# EAGLE design twip-pb1A (EAGLE 9.2.1)
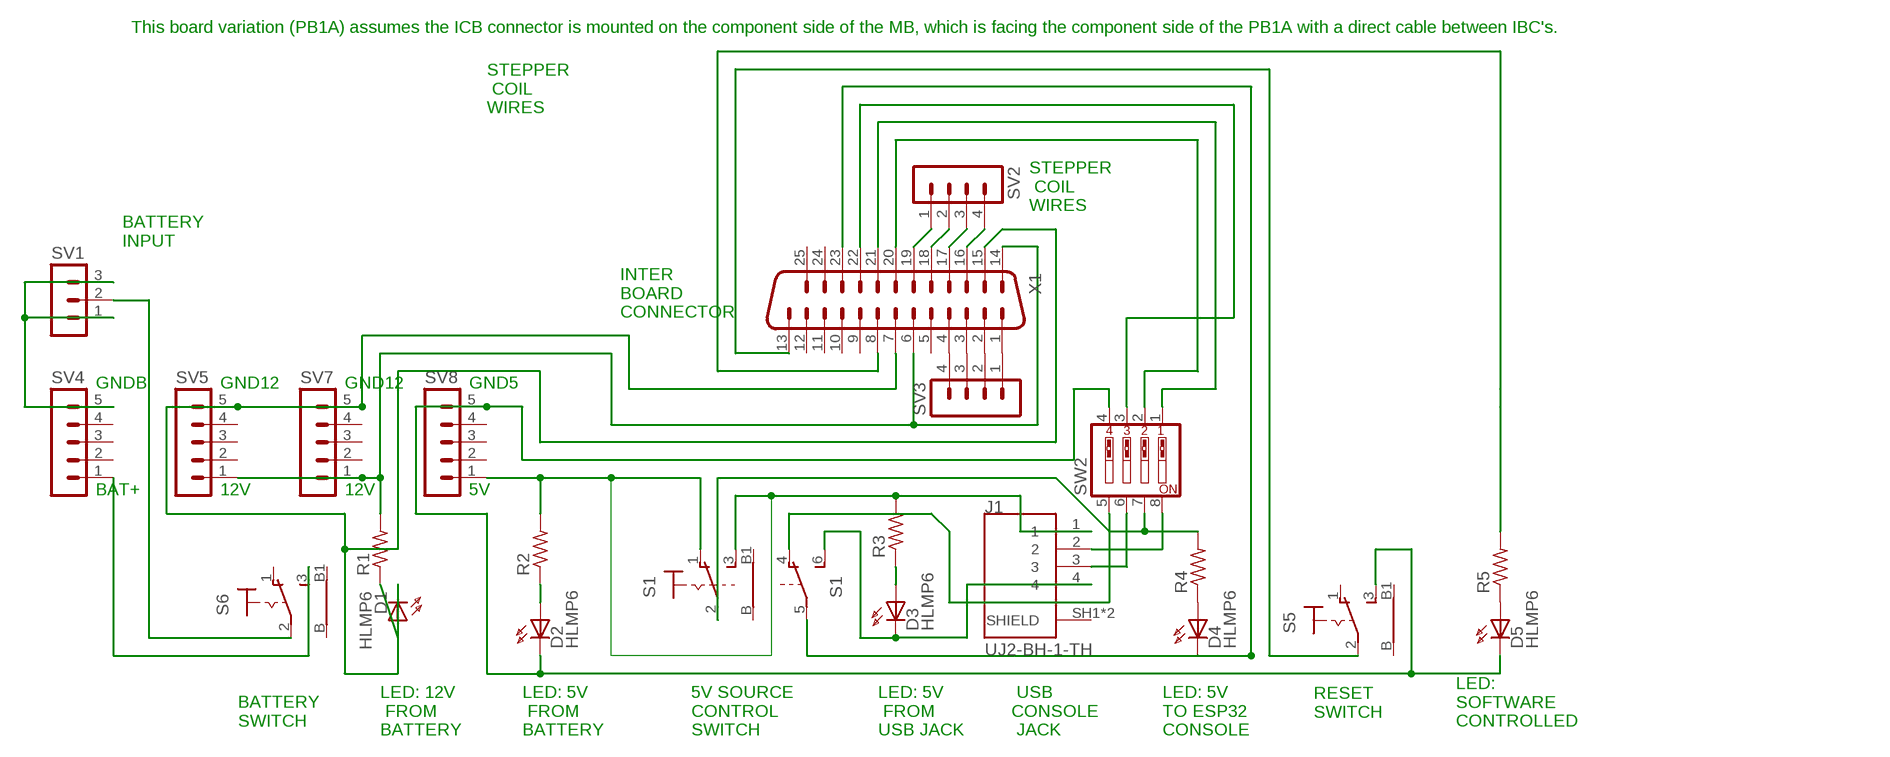
[diagram p0: schematic, sheet 1]

## Parts
D1  HLMP6  [HLMP6]
D2  HLMP6  [HLMP6]
D3  HLMP6  [HLMP6]
D4  HLMP6  [HLMP6]
D5  HLMP6  [HLMP6]
J1  UJ2-BH-1-TH  [CUI_UJ2-BH-1-TH]
R1  R-US_0207/5V  [0207/5V]
R2  R-US_0207/5V  [0207/5V]
R3  R-US_0207/5V  [0207/5V]
R4  R-US_0207/5V  [0207/5V]
R5  R-US_0207/5V  [0207/5V]
S1  9070-2W  [9070-2W]
S5  9070-1W  [9070-1W]
S6  9070-1W  [9070-1W]
SV1  MA03-1  [MA03-1]
SV2  MA04-1  [MA04-1]
SV3  MA04-1  [MA04-1]
SV4  MA05-1  [MA05-1]
SV5  MA05-1  [MA05-1]
SV7  MA05-1  [MA05-1]
SV8  MA05-1  [MA05-1]
SW2  SW_DIP-4  [EDG-04]
X1  M25VP  [M25VP]

## Nets
N$1: D1.A R1.1
N$2: D2.A R2.1
N$3: D3.A R3.1
N$4: D4.A R4.1
N$5: D5.A R5.1
N$6: SV1.1 SV1.3 SV4.5
N$7: S6.2(P) SV1.2
N$8: R1.2 SV5.1 SV7.1 X1.6 X1.14
N$9: J1.1 R2.2 R3.2 S1.1(1:O) S1.3(1:S) SV8.1
N$10: S6.3(S) SV4.1
N$11: SV2.1 X1.19
N$13: J1.2 SW2.8
N$14: SV3.4 X1.4
N$15: SV3.3 X1.3
N$16: SV3.2 X1.2
N$17: SV3.1 X1.1
N$18: SV2.2 X1.18
N$19: SV2.3 X1.17
N$20: SV2.4 X1.16
N$21: R5.2 X1.8
N$22: R4.2 S1.2(1:P) SW2.7
N$23: D3.K J1.4 S1.6(B:S)
N$24: SW2.1 X1.21
N$25: SW2.3 X1.22
N$26: SW2.2 X1.20
N$27: D4.K S1.5(B:P) X1.23
N$28: S5.2(P) X1.13
N$29: D1.K SV5.5 SV7.5 X1.7 X1.15
N$30: S1.4(B:O) SW2.5
N$31: D2.K D5.K S5.3(S) SV8.5 SW2.4
N$33: J1.3 SW2.6
Unconnected: J1.SH1(SHIELD) J1.SH2(SHIELD) S1.B1(1:B1) S1.B(1:B) S5.1(O) S5.B S5.B1 S6.1(O) S6.B S6.B1 SV4.2 SV4.3 SV4.4 SV5.2 SV5.3 SV5.4 SV7.2 SV7.3 SV7.4 SV8.2 SV8.3 SV8.4 X1.5 X1.9 X1.10 X1.11 X1.12 X1.24 X1.25 X1.G1 X1.G2

## Notes on the sheet
- This board variation (PB1A) assumes the ICB connector is mounted on the component side of the MB, which is facing the component side of the PB1A with a direct cable between IBC's.
- STEPPER
   COIL
  WIRES
- STEPPER
   COIL
  WIRES
- BATTERY
  INPUT
- INTER 
  BOARD 
  CONNECTOR
- GNDB | GND12 | GND12 | GND5
- BAT+ | 12V | 12V | 5V
- RESET
  SWITCH
- BATTERY 
  SWITCH
- LED: 
  SOFTWARE
  CONTROLLED
- LED: 12V
   FROM
  BATTERY
- LED: 5V
   FROM
  BATTERY
- 5V SOURCE
  CONTROL
  SWITCH
- LED: 5V
   FROM
  USB JACK
- USB
  CONSOLE
   JACK
- LED: 5V
  TO ESP32
  CONSOLE

## Library data of the parts
D1-D5 = display-hp:HLMP6: LED 2mm horizontal; MF: AGILENT TECHNOLOGIES; MPN: HLMP-6500; OC_FARNELL: 1652490; OC_NEWARK: 40K0088
J1 = UJ2-BH-1-TH:UJ2-BH-1-TH: 3 µin Plating Thickness, Black Insulator, USB Receptacle; MANUFACTURER: CUI INC; PART_REV: 1.0; STANDARD: MANUFACTURER RECOMENDATION
R1-R5 = resistor:R-US_: RESISTOR, American symbol
S1 = switch:9070-2W: TOGGLE SWITCH Marquardt
S5 S6 = switch:9070-1W: TOGGLE SWITCH Marquardt
SV1 = con-lstb:MA03-1: PIN HEADER; OC_FARNELL: unknown; OC_NEWARK: unknown
SV2 SV3 = con-lstb:MA04-1: PIN HEADER; OC_FARNELL: unknown; OC_NEWARK: unknown
SV4 SV5 SV7 SV8 = con-lstb:MA05-1: PIN HEADER; OC_FARNELL: unknown; OC_NEWARK: unknown
SW2 = special:SW_DIP-4: DIP SWITCH
X1 = con-subd:M25VP: SUB-D; OC_FARNELL: unknown; OC_NEWARK: unknown

## Board
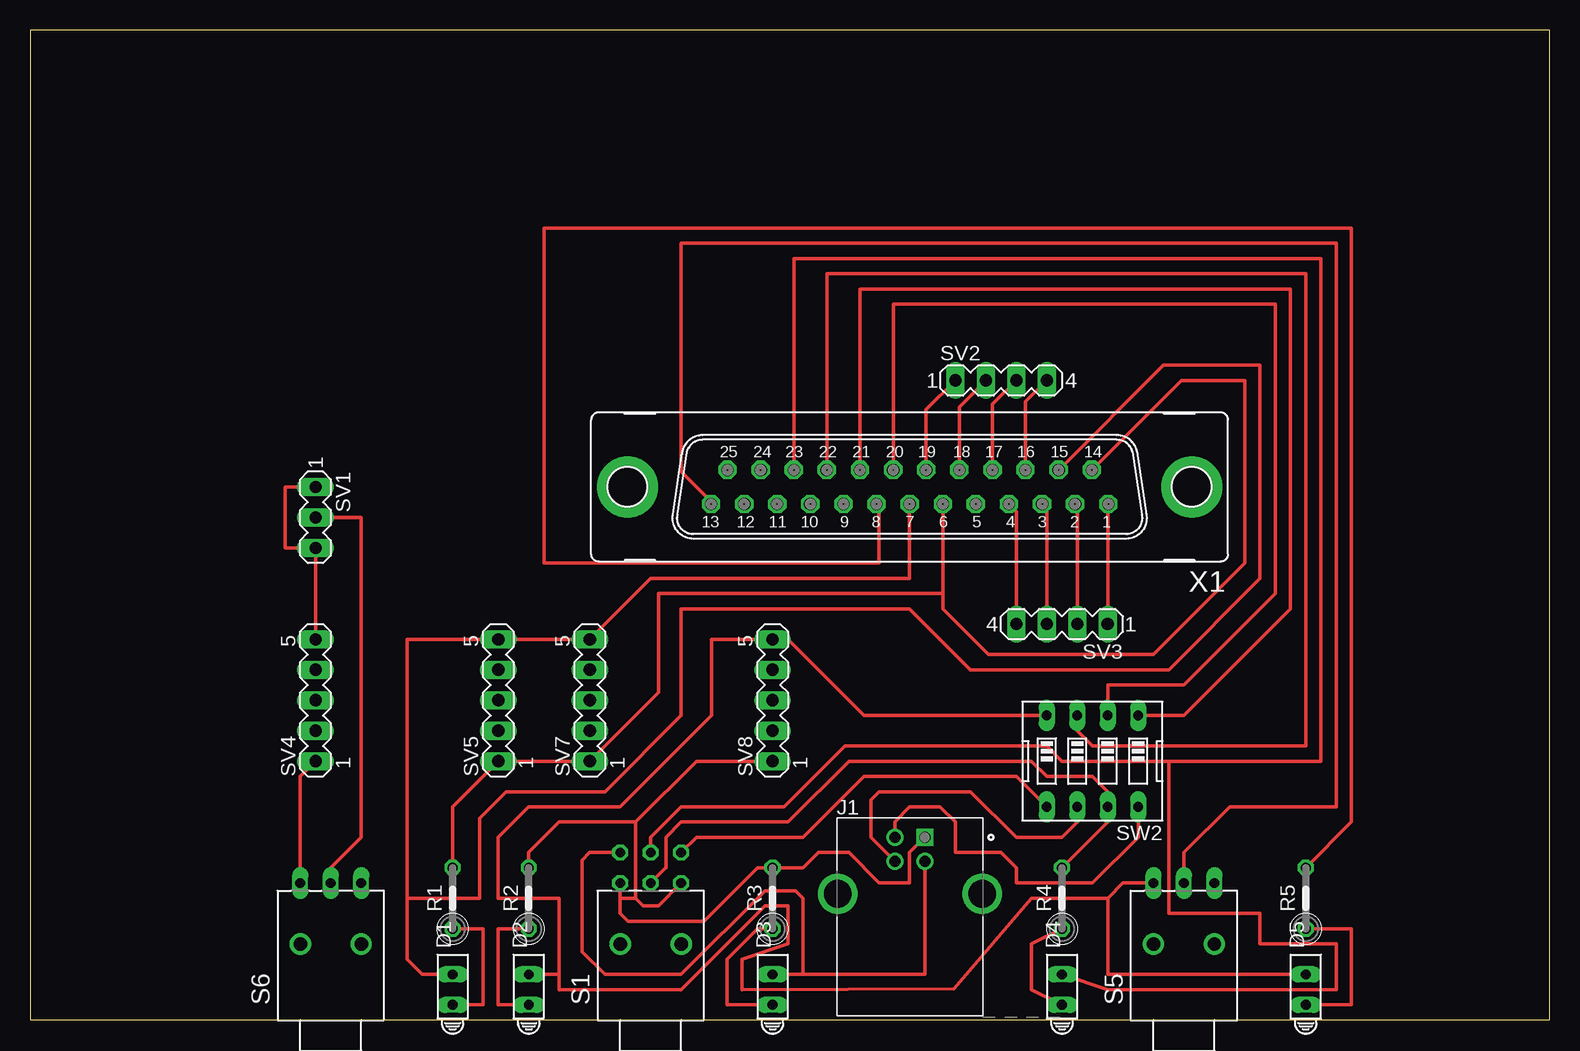
[diagram p1: board, top side]

Size 126.67 x 82.54 mm. Coordinates in mm from the lower left corner, seen from the top.
Outline: 126.67,82.54 0,82.54 0,0 126.67,0 126.67,82.54
Copper layers (1*16): Top 0.035mm / dielectric 1.5mm / Bottom 0.035mm
Design rules "default": minimum track width 6mil, minimum drill 0.35mm, track to track 6mil, track to pad 6mil, pad to pad 6mil, via to via 6mil, smd to smd 6mil, copper to edge 40mil, drill to drill 6mil, minimum pad ring 10mil, minimum via ring 8mil, stop-mask expansion 4mil, vias tented up to drill 0mil, thermal gap 10mil

### Footprints (pad centres in the part's own frame; a part is rotated, then mirrored left to right if it is on the bottom)
HLMP6 = drill 0.813 long: A -1.27,0; K 1.27,0
CUI_UJ2-BH-1-TH = drill 0.92 square: 1 0,0 | drill 0.92: 2 -2.5,0; 3 -2.5,-2; 4 0,-2 | drill 2.3: SH1 -7.27,-4.71; SH2 4.77,-4.71
0207/5V = drill 0.813 octagon: 1 -2.54,0; 2 2.54,0
9070-2W = drill 0.813 octagon: 1 5.08,-2.54; 2 5.08,0; 3 5.08,2.54; 4 7.62,-2.54; 5 7.62,0; 6 7.62,2.54 | drill 1.118 pad 1.778: B 0,-2.54; B1 0,2.54
9070-1W = drill 0.813 long: 1 5.08,-2.54; 2 5.08,0; 3 5.08,2.54 | drill 1.118 pad 1.778: B 0,-2.54; B1 0,2.54
MA03-1 = drill 1.016 long: 1 -2.54,0; 2 0,0; 3 2.54,0
MA04-1 = drill 1.016 long: 1 -3.81,0; 2 -1.27,0; 3 1.27,0; 4 3.81,0
MA05-1 = drill 1.016 long: 1 -5.08,0; 2 -2.54,0; 3 0,0; 4 2.54,0; 5 5.08,0
EDG-04 = drill 0.813 long: 1 -3.81,-3.81; 2 -1.27,-3.81; 3 1.27,-3.81; 4 3.81,-3.81; 5 3.81,3.81; 6 1.27,3.81; 7 -1.27,3.81; 8 -3.81,3.81
M25VP = drill 1.016 octagon: 1 -16.561,1.422; 2 -13.792,1.422; 3 -11.049,1.422; 4 -8.28,1.422; 5 -5.512,1.422; 6 -2.769,1.422; 7 0,1.422; 8 2.769,1.422; 9 5.512,1.422; 10 8.28,1.422; 11 11.049,1.422; 12 13.792,1.422; 13 16.561,1.422; 14 -15.189,-1.422; 15 -12.421,-1.422; 16 -9.652,-1.422; 17 -6.909,-1.422; 18 -4.14,-1.422; 19 -1.372,-1.422; 20 1.372,-1.422; 21 4.14,-1.422; 22 6.909,-1.422; 23 9.652,-1.422; 24 12.421,-1.422; 25 15.189,-1.422 | drill 3.302 pad 5.08: G1 -23.52,0; G2 23.52,0

### Placement (x,y rotation side)
D1  35.23,2.53 90 top
D2  41.58,2.53 90 top
D3  61.9,2.53 90 top
D4  86.03,2.53 90 top
D5  106.35,2.53 90 top
J1  74.6,15.23 0 top
R1  35.23,10.15 90 top
R2  41.58,10.15 90 top
R3  61.9,10.15 90 top
R4  86.03,10.15 90 top
R5  106.35,10.15 90 top
S1  51.74,6.34 90 top
S5  96.19,6.34 90 top
S6  25.07,6.34 90 top
SV1  23.8,41.9 270 top
SV2  80.95,53.33 0 top
SV3  86.03,33.01 180 top
SV4  23.8,26.66 90 top
SV5  39.04,26.66 90 top
SV7  46.66,26.66 90 top
SV8  61.9,26.66 90 top
SW2  88.57,21.58 180 top
X1  73.33,44.44 180 top

### Tracks (layer width: path | path; a pad name or v marks a point on that pad's centre or on a via)
N$1
  Top 0.305: R1.1 37.77,7.61 37.77,1.26 D1.A
N$2
  Top 0.305: R2.1 39.04,7.61 39.04,1.26 D2.A
N$3
  Top 0.305: D3.A 58.09,1.26 58.09,5.07 60.63,7.61 R3.1
N$4
  Top 0.305: D4.A 83.49,2.53 83.49,6.34 R4.1
N$5
  Top 0.305: R5.1 110.16,7.61 110.16,1.26 D5.A
N$6
  Top 0.305: SV4.5 SV1.3 21.26,39.36 21.26,44.44 SV1.1
N$7
  Top 0.305: SV1.2 27.61,41.9 27.61,15.23 25.07,12.69 S6.2
N$8
  Top 0.305: X1.14 95.99,53.33 101.27,53.33 101.27,38.09 93.65,30.47 79.91,30.47 76.1,34.28 76.1,35.55 | 76.1,35.55 X1.6 | 76.1,35.55 52.38,35.55 52.38,27.29 SV7.1 SV5.1 35.23,17.77 R1.2
N$9
  Top 0.305: S1.3 49.2,10.15 | 49.2,10.15 49.2,8.88 49.84,8.25 56.18,8.25 60.63,12.69 R3.2 64.44,12.69 65.71,13.96 68.25,13.96 70.79,11.42 73.33,11.42 73.33,13.96 J1.1 | SV8.1 55.55,21.58 50.47,16.5 | R2.2 41.58,13.96 44.12,16.5 50.47,16.5 | S1.1 52.38,9.51 51.1,9.51 50.47,10.15 | 50.47,10.15 50.47,16.5 | 49.2,10.15 50.47,10.15
N$10
  Top 0.305: SV4.1 22.53,20.31 S6.3
N$11
  Top 0.305: SV2.1 74.7,50.89 X1.19
N$13
  Top 0.305: J1.2 72.1,16.54 73.33,17.77 75.87,17.77 77.14,16.5 77.14,13.96 80.95,13.96 82.22,12.69 82.22,11.42 88.57,11.42 92.38,15.23 SW2.8
N$14
  Top 0.305: X1.4 82.22,42.41 SV3.4
N$15
  Top 0.305: X1.3 84.76,42.64 SV3.3
N$16
  Top 0.305: X1.2 87.3,42.84 SV3.2
N$17
  Top 0.305: SV3.1 89.84,42.97 X1.1
N$18
  Top 0.305: SV2.2 77.47,51.12 X1.18
N$19
  Top 0.305: SV2.3 80.24,51.35 X1.17
N$20
  Top 0.305: SV2.4 82.98,51.55 X1.16
N$21
  Top 0.305: X1.8 70.79,42.79 70.79,38.09 42.85,38.09 42.85,66.03 110.16,66.03 110.16,16.5 R5.2
N$22
  Top 0.305: R4.2 89.84,16.5 SW2.7 89.84,19.04 88.57,20.31 84.76,20.31 83.49,21.58 68.25,21.58 63.17,16.5 54.28,16.5 53.01,15.23 53.01,12.69 53.02,12.68 53,12.68 S1.2
N$23
  Top 0.305: 64.44,3.8 64.44,10.15 63.8,10.79 61.27,10.79 54.28,3.8 47.93,3.8 46.02,5.71 46.02,13.32 46.66,13.96 S1.6 | 64.44,3.8 D3.K | 64.44,3.8 74.6,3.8 J1.4
N$24
  Top 0.305: X1.21 69.19,60.95 105.08,60.95 105.08,34.28 96.19,25.39 SW2.1
N$25
  Top 0.305: X1.22 66.42,62.22 106.35,62.22 106.35,22.85 88.57,22.85 87.3,24.12 SW2.3
N$26
  Top 0.305: 72.06,45.71 71.96,45.81 X1.20 71.96,59.68 103.81,59.68 103.81,35.55 96.19,27.93 89.84,27.93 SW2.2
N$27
  Top 0.305: D4.K 89.84,2.53 108.89,2.53 108.89,6.34 102.54,6.34 102.54,8.88 94.92,8.88 94.92,21.58 | S1.5 51.74,15.23 54.28,17.77 62.86,17.77 67.95,22.85 84.76,22.85 86.03,21.58 94.92,21.58 | X1.23 63.68,63.49 107.62,63.49 107.62,21.58 94.92,21.58
N$28
  Top 0.305: X1.13 56.77,43.22 54.28,45.71 54.28,64.76 108.89,64.76 108.89,17.77 100,17.77 96.19,13.96 S5.2
N$29
  Top 0.305: 31.42,10.15 31.42,5.07 32.69,3.8 D1.K | 31.42,10.15 31.42,31.74 SV5.5 SV7.5 51.74,36.82 73.33,36.82 X1.7 | X1.15 94.49,54.6 102.54,54.6 102.54,36.82 94.92,29.2 78.41,29.2 73.33,34.28 54.28,34.28 54.28,25.39 47.93,19.04 39.7,19.04 37.46,16.8 37.46,10.15 31.42,10.15
N$30
  Top 0.305: S1.4 55.55,15.23 64.44,15.23 69.52,20.31 82.22,20.31 SW2.5
N$31
  Top 0.305: 89.84,10.15 83.49,10.15 77.04,2.62 59.36,2.53 59.36,5.07 63.17,6.34 63.17,9.51 61.27,9.51 54.28,2.53 44.12,2.53 44.12,3.8 | 44.12,3.8 44.12,10.15 39.04,10.15 39.04,15.23 41.58,17.77 49.2,17.77 56.82,25.39 56.82,31.74 SV8.5 63.17,31.74 69.52,25.39 SW2.4 | 44.12,3.8 D2.K | D5.K 89.84,3.8 89.84,10.15 | 89.84,10.15 91.11,11.42 S5.3
N$33
  Top 0.305: J1.3 70.1,15.23 70.1,18.35 70.79,19.04 78.41,19.04 82.22,15.23 86.03,15.23 87.3,16.5 SW2.6
(copper drawn outside any net)
  shapes: Top area x2